# Altium schematic sheet 基板.SchDoc
size A4
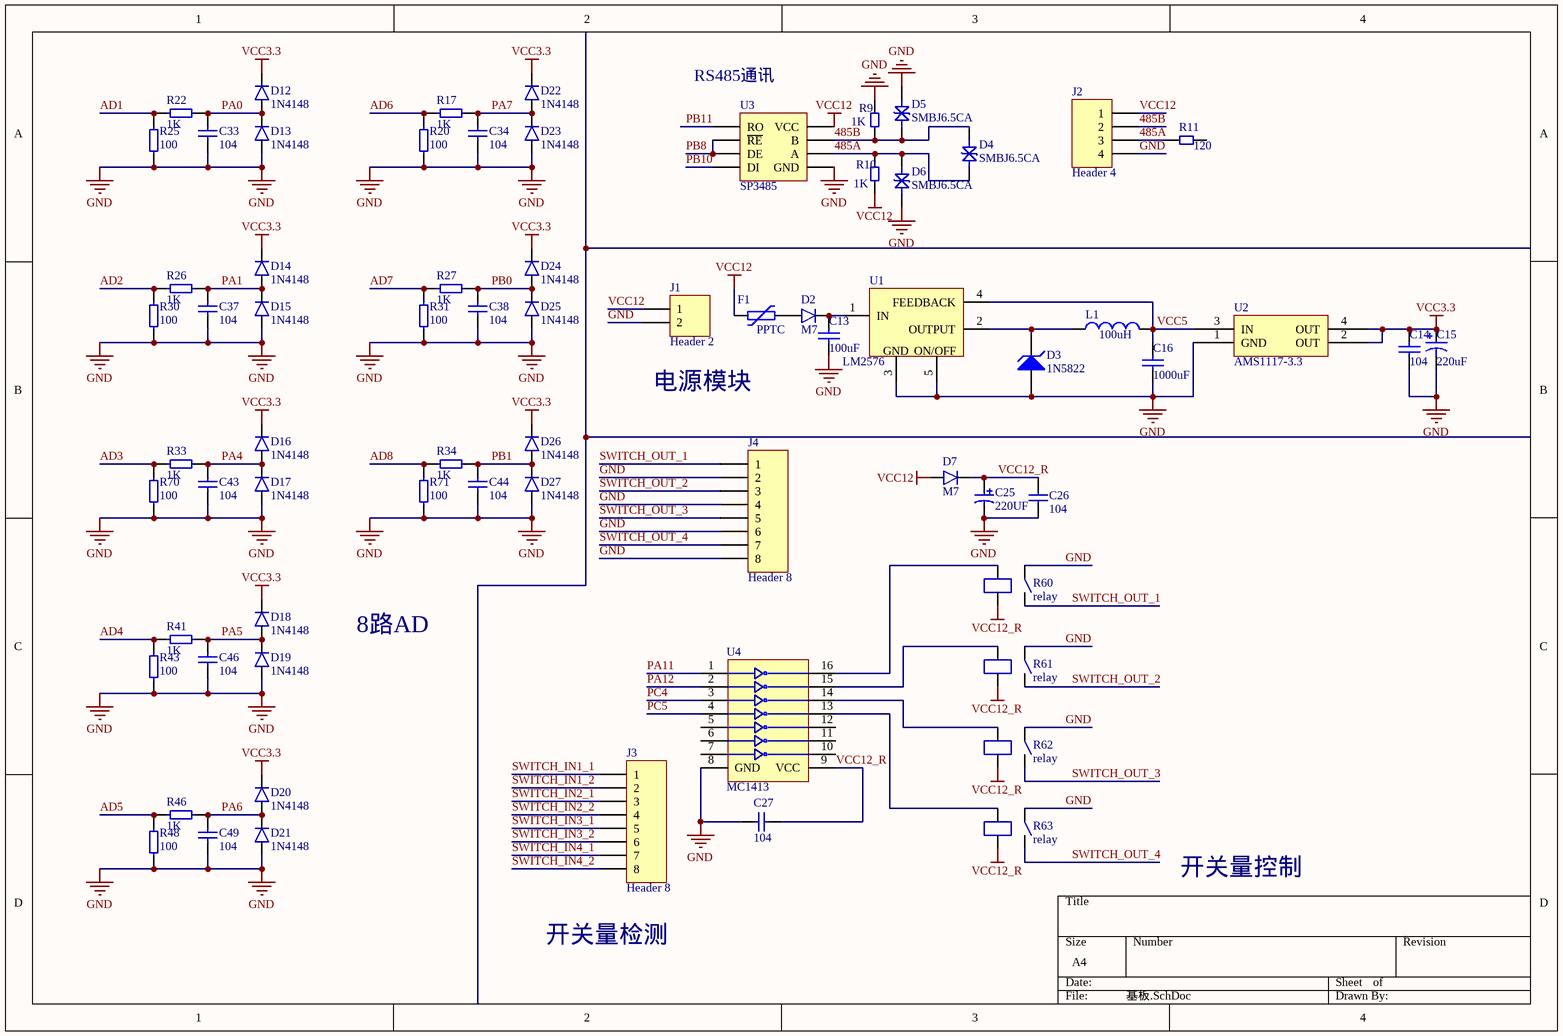
[diagram p0: 基板.SchDoc]

## Parts
C13  value 100uF  [cap3.3-8 - duplicate]
C14  value 104  [0805]  (hidden comment: Cap)
C15  value 220uF  [C15]  (hidden comment: Cap Pol1)
C16  value 1000uF  [C16]
C25  220UF  [RB 2.5/6.3]
C26  104  [0805C]
C27  104  [0805C]
C33  104  [0805C]
C34  104  [0805C]
C37  104  [0805C]
C38  104  [0805C]
C43  104  [0805C]
C44  104  [0805C]
C46  104  [0805C]
C49  104  [0805C]
D2  M7  [SMA (DO-214AC)]
D3  1N5822  [smb do214aa]
D4  SMBJ6.5CA  [smb do214aa]
D5  SMBJ6.5CA  [smb do214aa]
D6  SMBJ6.5CA  [smb do214aa]
D7  M7  [SMA (DO-214AC)]
D12  1N4148  [SOD 323]
D13  1N4148  [SOD 323]
D14  1N4148  [SOD 323]
D15  1N4148  [SOD 323]
D16  1N4148  [SOD 323]
D17  1N4148  [SOD 323]
D18  1N4148  [SOD 323]
D19  1N4148  [SOD 323]
D20  1N4148  [SOD 323]
D21  1N4148  [SOD 323]
D22  1N4148  [SOD 323]
D23  1N4148  [SOD 323]
D24  1N4148  [SOD 323]
D25  1N4148  [SOD 323]
D26  1N4148  [SOD 323]
D27  1N4148  [SOD 323]
F1  PPTC  [1206]
J1  Header 2  [J1_2P]
J2  Header 4  [J2_4P]
J3  Header 8  [J3_8P]
J4  Header 8  [J3_8P]
L1  value 100uH  [l1212]
R9  1K  [0805]
R10  1K  [0805]
R11  120  [0805]
R17  1K  [0805R]
R20  100  [0805R]
R22  1K  [0805R]
R25  100  [0805R]
R26  1K  [0805R]
R27  1K  [0805R]
R30  100  [0805R]
R31  100  [0805R]
R33  1K  [0805R]
R34  1K  [0805R]
R41  1K  [0805R]
R43  100  [0805R]
R46  1K  [0805R]
R48  100  [0805R]
R60  relay  [HF49FD/012-1H11]
R61  relay  [HF49FD/012-1H11]
R62  relay  [HF49FD/012-1H11]
R63  relay  [HF49FD/012-1H11]
R70  100  [0805R]
R71  100  [0805R]
U1  LM2576  [TO-263-5]
U2  AMS1117-3.3  [AMS1117-3.3]
U3  SP3485  [sop8]
U4  MC1413  [SOP 16-1.27/3.9]

## Nets
GND: C13.1 C14.1 C15.2 C16.1 C25.1 C26.1 C27.1 C33.1 C34.1 C37.1 C38.1 C43.1 C44.1 C46.1 C49.1 D3.1(A) D5.1 D6.2 D13.2(+) D15.2(+) D17.2(+) D19.2(+) D21.2(+) D23.2(+) D25.2(+) D27.2(+) J1.2 J2.4 J4.2 J4.4 J4.6 J4.8 R9.2 R20.1 R25.1 R30.1 R31.1 R43.1 R48.1 R60.3 R61.3 R62.3 R63.3 R70.1 R71.1 U1.3 U1.5 U2.1(GND) U3.5(GND) U4.8(GND)
VCC3.3: C14.2 C15.1 D12.1(-) D14.1(-) D16.1(-) D18.1(-) D20.1(-) D22.1(-) D24.1(-) D26.1(-) U2.2(OUT) U2.4(OUT)
VCC12: D7.2(+) F1.1 J1.1 J2.1 R10.1 U3.8(VCC)
VCC12_R: C25.2 C26.2 C27.2 D7.1(-) R60.2 R61.2 R62.2 R63.2 U4.9(VCC)
485A: D4.2 D6.1 J2.3 R10.2 R11.2 U3.6(A)
485B: D4.1 D5.2 J2.2 R9.1 U3.7(B)
AD1: R22.2 R25.2
AD2: R26.2 R30.2
AD3: R33.2 R70.2
AD4: R41.2 R43.2
AD5: R46.2 R48.2
AD6: R17.2 R20.2
AD7: R27.2 R31.2
AD8: R34.2 R71.2
PA0: C33.2 D12.2(+) D13.1(-) R22.1
PA1: C37.2 D14.2(+) D15.1(-) R26.1
PA4: C43.2 D16.2(+) D17.1(-) R33.1
PA5: C46.2 D18.2(+) D19.1(-) R41.1
PA6: C49.2 D20.2(+) D21.1(-) R46.1
PA7: C34.2 D22.2(+) D23.1(-) R17.1
PA11: U4.1
PA12: U4.2
PB0: C38.2 D24.2(+) D25.1(-) R27.1
PB1: C44.2 D26.2(+) D27.1(-) R34.1
PB8: U3.2(~{RE}) U3.3(DE)
PB10: U3.4(DI)
PB11: U3.1(RO)
PC4: U4.3
PC5: U4.4
SWITCH_IN1_1: J3.1
SWITCH_IN1_2: J3.2
SWITCH_IN2_1: J3.3
SWITCH_IN2_2: J3.4
SWITCH_IN3_1: J3.5
SWITCH_IN3_2: J3.6
SWITCH_IN4_1: J3.7
SWITCH_IN4_2: J3.8
SWITCH_OUT_1: J4.1 R60.4
SWITCH_OUT_2: J4.3 R61.4
SWITCH_OUT_3: J4.5 R62.4
SWITCH_OUT_4: J4.7 R63.4
VCC5: C16.2 L1.2 U1.4(FEEDBACK) U2.3(IN)
NetC13_2: C13.2 D2.1(-) U1.1(IN)
NetD2_2: D2.2(+) F1.2
NetD3_2: D3.2(K) L1.1 U1.2(OUTPUT)
NetR60_1: R60.1 U4.16
NetR61_1: R61.1 U4.15
NetR62_1: R62.1 U4.14
NetR63_1: R63.1 U4.13

Not connected (* = marked no-connect by the designer): R11 1; U4 5 6 7 10 11 12

## Notes on the sheet
- (near U3) RS485通讯
- (near U1) GND
- (near U1) ON/OFF
- 8路AD
- Labels drawn without touching a wire or pin: 开关量控制, 开关量检测, 电源模块

## Library data of the parts
C13 C14 C16 = Cap: Capacitor; Published: 8-Jun-2000; LatestRevisionDate: 17-Jul-2002; LatestRevisionNote: Re-released for DXP Platform.; PackageReference: RAD-0.3; Publisher: Altium Limited; PackageDescription: Radial Cap, Thru-Hole; 2 Leads; 0.3 in Pin Spacing
C15 = Cap Pol1: Polarized Capacitor (Radial); Published: 8-Jun-2000; LatestRevisionDate: 17-Jul-2002; LatestRevisionNote: Re-released for DXP Platform.; PackageReference: RB7.6-15; Publisher: Altium Limited; PackageDescription: Polarized Capacitor (Radial); 2 Leads
C25 = CAP-POL2
C26 C27 C33 C34 C37 C38 C43 C44 C46 C49 = CAP
D3 = D Zener: Zener Diode; Published: 8-Jun-2000; LatestRevisionDate: 17-Jul-2002; LatestRevisionNote: Re-released for DXP Platform.; PackageReference: DIODE-0.7; Publisher: Altium Limited; PackageDescription: Diode, Thru-Hole; 2 Leads; 0.7 in Pin Spacing
J1 = Header 2: Header, 2-Pin; LatestRevisionDate: 17-Jul-2002; LatestRevisionNote: Re-released for DXP Platform.; Publisher: Altium Limited
J2 = Header 4: Header, 4-Pin; LatestRevisionDate: 17-Jul-2002; LatestRevisionNote: Re-released for DXP Platform.; Publisher: Altium Limited
J3 J4 = Header 8: Header, 8-Pin; LatestRevisionDate: 17-Jul-2002; LatestRevisionNote: Re-released for DXP Platform.; Publisher: Altium Limited
L1 = Inductor: Code_IEC: 1005; Published: 8-Jun-2000; LatestRevisionDate: 29-May-2009; LatestRevisionNote: IPC-7351 Footprint Added.; PackageReference: 0402-A; Publisher: Altium Limited; PackageDescription: Chip Inductor; Code_JEITA: 0402
R9-R11 = Res
R17 R20 R22 R25-R27 R30 R31 R33 R34 R41 R43 R46 R48 R70 R71 = RES